# EAGLE design zmFPGA (EAGLE 8.6.3)
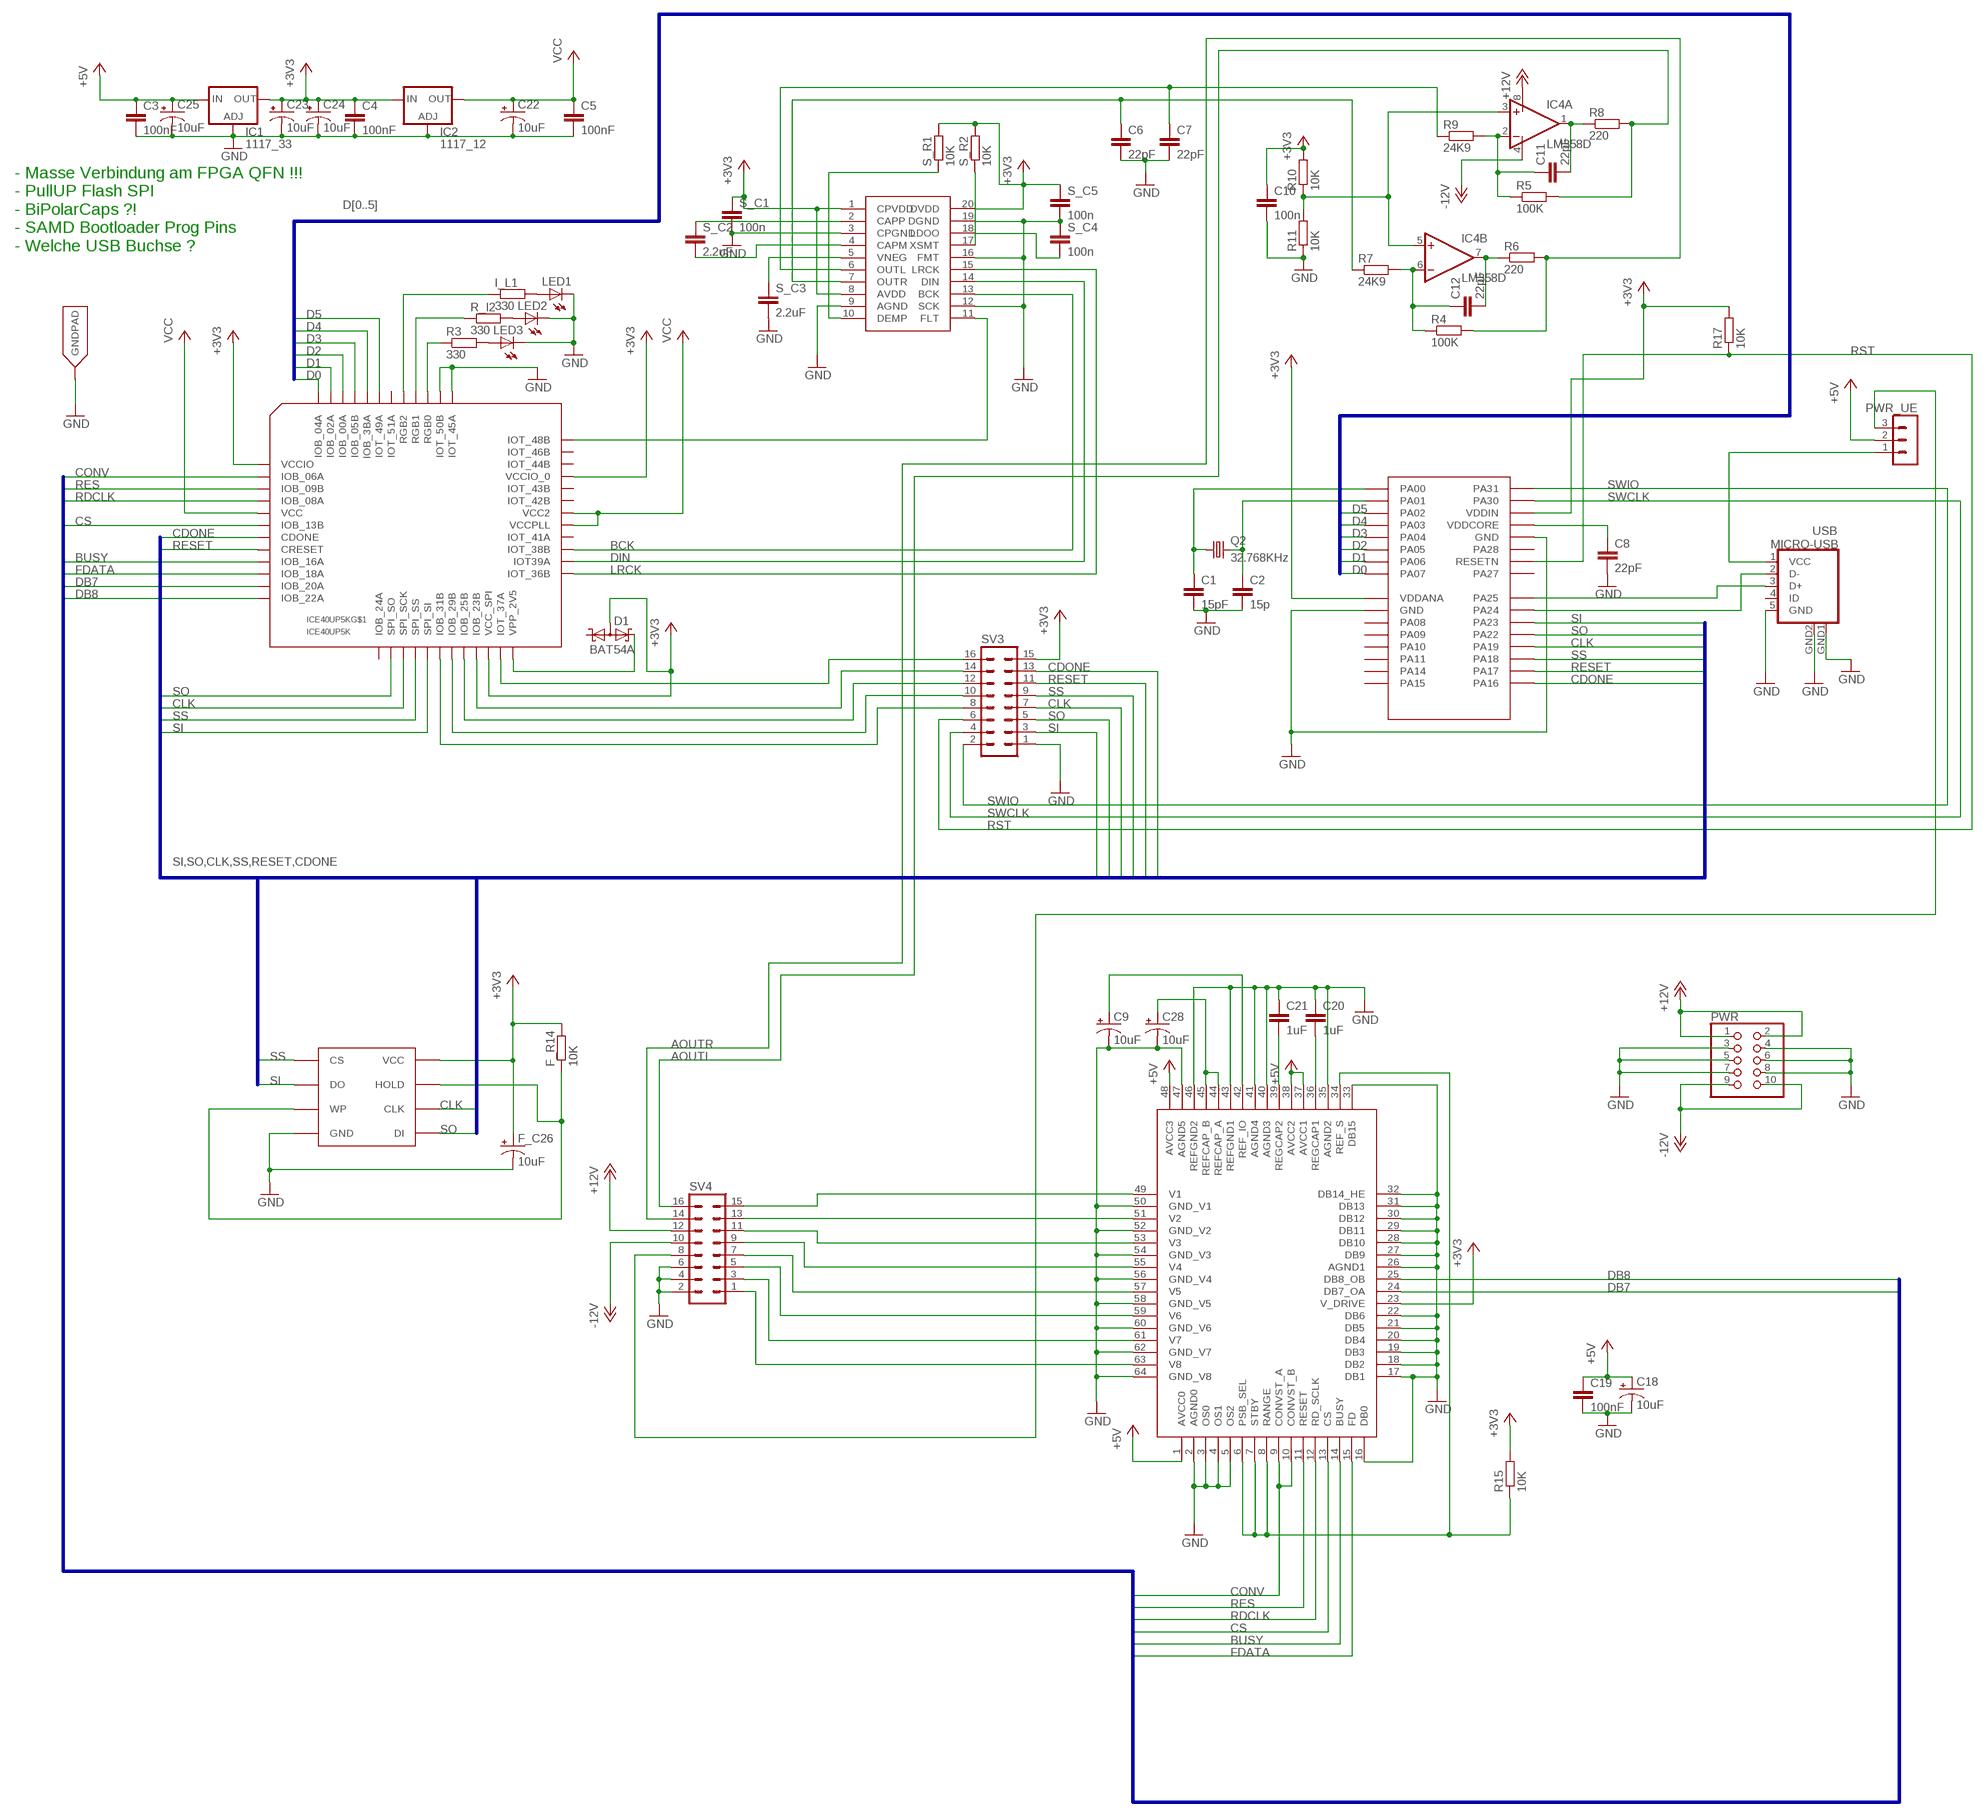
[diagram p0: schematic, sheet 1]

## Parts
AD7606  AD7606  [LQFP64]
C1  15pF  C-EUC0805  [C0805]
C2  15p  C-EUC0805  [C0805]
C3  100nF  C-EUC0805  [C0805]
C4  100nF  C-EUC0805  [C0805]
C5  100nF  C-EUC0805  [C0805]
C6  22pF  C-EUC0805  [C0805]
C7  22pF  C-EUC0805  [C0805]
C8  22pF  C-EUC0805  [C0805]
C9  10uF  10UF-POLAR-EIA3216-16V-10%(TANT)  [EIA3216]
C10  100n  C-EUC0805  [C0805]
C11  22pF  C-EUC0805  [C0805]
C12  22pF  C-EUC0805  [C0805]
C18  10uF  10UF-POLAR-EIA3216-16V-10%(TANT)  [EIA3216]
C19  100nF  C-EUC0805  [C0805]
C20  1uF  C-EUC0805  [C0805]
C21  1uF  C-EUC0805  [C0805]
C22  10uF  10UF-POLAR-EIA3216-16V-10%(TANT)  [EIA3216]
C23  10uF  10UF-POLAR-EIA3216-16V-10%(TANT)  [EIA3216]
C24  10uF  10UF-POLAR-EIA3216-16V-10%(TANT)  [EIA3216]
C25  10uF  10UF-POLAR-EIA3216-16V-10%(TANT)  [EIA3216]
C28  10uF  10UF-POLAR-EIA3216-16V-10%(TANT)  [EIA3216]
D1  BAT54A  [SOT23]
F_C26  10uF  10UF-POLAR-EIA3216-16V-10%(TANT)  [EIA3216]
F_R14  10K  R-EU_R0805  [R0805]
I_L1  330  R-EU_R0805  [R0805]
IC1  1117_33  LD117AS33TR  [SOT223]
IC2  1117_12  LD117AS12TR  [SOT223]
IC4  LM358D  [SO08]
ICE40UP5K  ICE40UP5K  ICE40UP5K_QFN48  [QFN48]
LED1  LEDSMT1206  [1206]
LED2  LEDSMT1206  [1206]
LED3  LEDSMT1206  [1206]
PCM5102  PCM5102  [TSSOP20]
PWR  PINHD-2X5  [2X05]
PWR_UE  MA03-1  [MA03-1]
Q2  32.768KHz  CRYSTALMM39SL  [MM39SL]
R3  330  R-EU_R0805  [R0805]
R4  100K  R-EU_R0805  [R0805]
R5  100K  R-EU_R0805  [R0805]
R6  220  R-EU_R0805  [R0805]
R7  24K9  R-EU_R0805  [R0805]
R8  220  R-EU_R0805  [R0805]
R9  24K9  R-EU_R0805  [R0805]
R10  10K  R-EU_R0805  [R0805]
R11  10K  R-EU_R0805  [R0805]
R15  10K  R-EU_R0805  [R0805]
R17  10K  R-EU_R1206  [R1206]
R_I2  330  R-EU_R0805  [R0805]
S_C1  100n  C-EUC0805  [C0805]
S_C2  2.2uF  C-EUC0805  [C0805]
S_C3  2.2uF  C-EUC0805  [C0805]
S_C4  100n  C-EUC0805  [C0805]
S_C5  100n  C-EUC0805  [C0805]
S_R1  10K  R-EU_R0805  [R0805]
S_R2  10K  R-EU_R0805  [R0805]
SV3  MA08-2  [MA08-2]
SV4  MA08-2  [MA08-2]
U$1  W25Q32  [SOP-8]
U$2  SAMD21_TQFP32  [32-TQFP]
USB  MICRO-USB  [MICRO-USB]

## Nets
5VEXT: PWR_UE.3 SV4.8
+3V3 [VCC]: AD7606.23(V_DRIVE) C4.1 C10.1 C23.+ C24.+ D1.3(AA) F_C26.+ F_R14.2 IC1.4(OUT) IC2.3(IN) ICE40UP5K.1(VCCIO) ICE40UP5K.22(VCC_SPI) ICE40UP5K.33(VCCIO_0) PCM5102.1(CPVDD) PCM5102.8(AVDD) PCM5102.20(DVDD) R10.2 R15.2 R17.2 S_C1.1 S_C5.1 S_R1.2 S_R2.2 SV3.15 U$1.8(VCC) U$2.9(VDDANA) U$2.30(VDDIN)
+5V: AD7606.1(AVCC0) AD7606.37(AVCC1) AD7606.38(AVCC2) AD7606.48(AVCC3) C3.1 C18.+ C19.1 C25.+ IC1.3(IN) PWR_UE.2
+12V: IC4.8(P:V+) PWR.1 PWR.2 SV4.12
-12V: IC4.4(P:V-) PWR.9 PWR.10 SV4.10
AOUTL: R5.2 R8.2 SV4.16
AOUTR: R4.2 R6.2 SV4.14
B23: ICE40UP5K.21(IOB_23B) SV3.14
B25: ICE40UP5K.20(IOB_25B) SV3.12
B29: ICE40UP5K.19(IOB_29B) SV3.10
B31: ICE40UP5K.18(IOB_31B) SV3.8
BCK: ICE40UP5K.27(IOT_38B) PCM5102.13(BCK)
BUSY: AD7606.14(BUSY) ICE40UP5K.9(IOB_16A)
CAPM: PCM5102.4(CAPM) S_C2.2
CAPP: PCM5102.2(CAPP) S_C2.1
CDONE: ICE40UP5K.7(CDONE) SV3.13 U$2.17(PA16)
CLK: ICE40UP5K.15(SPI_SCK) SV3.7 U$1.6(CLK) U$2.20(PA19)
CONV: AD7606.9(CONVST_A) AD7606.10(CONVST_B) ICE40UP5K.2(IOB_06A)
CS: AD7606.13(CS) ICE40UP5K.6(IOB_13B)
D0: ICE40UP5K.48(IOB_04A) U$2.8(PA07)
D1: ICE40UP5K.47(IOB_02A) U$2.7(PA06)
D2: ICE40UP5K.46(IOB_00A) U$2.6(PA05)
D3: ICE40UP5K.45(IOB_05B) U$2.5(PA04)
D4: ICE40UP5K.44(IOB_3BA) U$2.4(PA03)
D5: ICE40UP5K.43(IOT_49A) U$2.3(PA02)
D+: U$2.24(PA25) USB.3(D+)
D-: U$2.23(PA24) USB.2(D-)
DB7: AD7606.24(DB7_OA) ICE40UP5K.11(IOB_20A)
DB8: AD7606.25(DB8_OB) ICE40UP5K.12(IOB_22A)
DIN: ICE40UP5K.26(IOT39A) PCM5102.14(DIN)
FDATA: AD7606.15(FD) ICE40UP5K.10(IOB_18A)
FLASH_H: F_R14.1 U$1.3(WP) U$1.7(HOLD)
FLT: ICE40UP5K.36(IOT_48B) PCM5102.11(FLT)
GND [GND]: AD7606.2(AGND0) AD7606.3(OS0) AD7606.4(OS1) AD7606.5(OS2) AD7606.16(DB0) AD7606.17(DB1) AD7606.18(DB2) AD7606.19(DB3) AD7606.20(DB4) AD7606.21(DB5) AD7606.22(DB6) AD7606.26(AGND1) AD7606.27(DB9) AD7606.28(DB10) AD7606.29(DB11) AD7606.30(DB12) AD7606.31(DB13) AD7606.32(DB14_HE) AD7606.33(DB15) AD7606.35(AGND2) AD7606.40(AGND3) AD7606.41(AGND4) AD7606.43(REFGND1) AD7606.46(REFGND2) AD7606.47(AGND5) AD7606.50(GND_V1) AD7606.52(GND_V2) AD7606.54(GND_V3) AD7606.56(GND_V4) AD7606.58(GND_V5) AD7606.60(GND_V6) AD7606.62(GND_V7) AD7606.64(GND_V8) C1.2 C2.2 C3.2 C4.2 C5.2 C6.2 C7.2 C8.2 C9.- C10.2 C18.- C19.2 C20.1 C21.1 C22.- C23.- C24.- C25.- C28.- F_C26.- IC1.1(ADJ) IC2.1(ADJ) ICE40UP5K.37(IOT_45A) ICE40UP5K.38(IOT_50B) ICE40UP5K.EXP(GNDPAD) LED1.C LED2.C LED3.C PCM5102.3(CPGND) PCM5102.9(AGND) PCM5102.12(SCK) PCM5102.16(FMT) PCM5102.19(DGND) PWR.3 PWR.4 PWR.5 PWR.6 PWR.7 PWR.8 R11.1 S_C1.2 S_C3.2 S_C4.1 S_C5.2 SV3.1 SV4.2 SV4.4 SV4.6 U$1.4(GND) U$2.10(GND) U$2.28(GND) USB.5(GND) USB.GND1(GND) USB.GND2(GND)
LRCK: ICE40UP5K.25(IOT_36B) PCM5102.15(LRCK)
N$1: C8.1 U$2.29(VDDCORE)
N$6: AD7606.63(V8) SV4.1
N$7: AD7606.61(V7) SV4.3
N$8: AD7606.59(V6) SV4.5
N$12: D1.2(K2) ICE40UP5K.24(VPP_2V5)
N$13: AD7606.57(V5) SV4.7
N$14: AD7606.55(V4) SV4.9
N$16: AD7606.53(V3) SV4.11
N$17: AD7606.51(V2) SV4.13
N$19: LED3.A R3.2
N$20: LED2.A R_I2.2
N$21: I_L1.2 LED1.A
N$22: ICE40UP5K.39(RGB0) R3.1
N$23: ICE40UP5K.40(RGB1) R_I2.1
N$24: I_L1.1 ICE40UP5K.41(RGB2)
N$25: C12.2 IC4.7(B:OUT) R6.1
N$26: C11.2 IC4.1(A:OUT) R8.1
N$27: C11.1 IC4.2(A:-IN) R5.1 R9.2
N$29: C12.1 IC4.6(B:-IN) R4.1 R7.2
N$37: PCM5102.17(XSMT) S_R2.1
N$38: PCM5102.10(DEMP) S_R1.1
N$39: PCM5102.18(LDOO) S_C4.2
N$40: AD7606.49(V1) SV4.15
OUTL: C7.1 PCM5102.6(OUTL) R9.1
OUTR: C6.1 PCM5102.7(OUTR) R7.1
PULLUP: AD7606.6(PSB_SEL) AD7606.7(STBY) AD7606.8(RANGE) AD7606.34(REF_S) R15.1
Q1: C1.1 Q2.1 U$2.1(PA00)
Q2: C2.1 Q2.4 U$2.2(PA01)
RDCLK: AD7606.12(RD_SCLK) ICE40UP5K.4(IOB_08A)
REF_INOUT: AD7606.42(REF_IO) C9.+
REFCAP: AD7606.44(REFCAP_A) AD7606.45(REFCAP_B) C28.+
REGCAP1: AD7606.36(REGCAP1) C20.2
REGCAP2: AD7606.39(REGCAP2) C21.2
RES: AD7606.11(RESET) ICE40UP5K.3(IOB_09B)
RESET: ICE40UP5K.8(CRESET) SV3.11 U$2.18(PA17)
RST: R17.1 SV3.6 U$2.26(RESETN)
SI: ICE40UP5K.17(SPI_SI) SV3.3 U$1.2(DO) U$2.22(PA23)
SO: ICE40UP5K.14(SPI_SO) SV3.5 U$1.5(DI) U$2.21(PA22)
SS: ICE40UP5K.16(SPI_SS) SV3.9 U$1.1(CS) U$2.19(PA18)
SWCLK: SV3.4 U$2.31(PA30)
SWIO: SV3.2 U$2.32(PA31)
T37: ICE40UP5K.23(IOT_37A) SV3.16
USB_5V: PWR_UE.1 USB.1(VCC)
V165: IC4.3(A:+IN) IC4.5(B:+IN) R10.1 R11.2
VCC: C5.1 C22.+ IC2.4(OUT) ICE40UP5K.5(VCC) ICE40UP5K.29(VCCPLL) ICE40UP5K.30(VCC2)
VNEG: PCM5102.5(VNEG) S_C3.1
Unconnected: D1.1(K1) ICE40UP5K.13(IOB_24A) ICE40UP5K.28(IOT_41A) ICE40UP5K.31(IOT_42B) ICE40UP5K.32(IOT_43B) ICE40UP5K.34(IOT_44B) ICE40UP5K.35(IOT_46B) ICE40UP5K.42(IOT_51A) U$2.11(PA08) U$2.12(PA09) U$2.13(PA10) U$2.14(PA11) U$2.15(PA14) U$2.16(PA15) U$2.25(PA27) U$2.27(PA28) USB.4(ID)

## Buses
D[0..5]
SI,SO,CLK,SS,RESET,CDONE
CONV,RES,RDCLK,CS,BUSY,FDATA,DB7,DB8

## Notes on the sheet
- - Masse Verbindung am FPGA QFN !!!
  - PullUP Flash SPI
  - BiPolarCaps ?!
  - SAMD Bootloader Prog Pins
  - Welche USB Buchse ?

## Library data of the parts
AD7606 = nxp_packages:AD7606
C1-C8 C10-C12 C19-C21 S_C1-S_C5 = rcl:C-EU: CAPACITOR, European symbol; SPICEPREFIX: C
C9 C18 C22-C25 C28 F_C26 = SparkFun-Capacitors:10UF-POLAR: 10.0µF polarized capacitors A capacitor is a passive two-terminal electrical component used to store electrical energy temporarily in an electric field.; PROD_ID: CAP-00811
D1 = diode:BAT54A: Schottky Diodes Source: Fairchild .. BAT54.pdf
F_R14 I_L1 R3-R11 R15 R17 R_I2 S_R1 S_R2 = rcl:R-EU_: RESISTOR, European symbol; SPICEPREFIX: R
IC1 IC2 = v-reg:LD117A?*: Low drop fixed and adjustable positive voltage regulators 1 A Source: http://www.st.com/stonline/products/literature/ds/7194/ld1117axx.pdf
IC4 = linear:LM358: OP AMP also LM158; LM258; LM2904 Source: http://cache.national.com/ds/LM/LM158.pdf
ICE40UP5K = ice40up5_qfn48:ICE40UP5K_QFN48
LED1-LED3 = led:LED: LED OSRAM: - CHIPLED LG R971, LG N971, LY N971, LG Q971, LY Q971, LO R971, LY R971 LH N974, LH R974 LS Q976, LO Q976, LY Q976 LO Q996 - Hyper CHIPLED LW Q18S LB Q993, LB Q99A, LB R99A - SideLED LS A670, LO A670, LY A670, LG A670, LP A670 LB A673, LV A673, LT A673, LW A673 LH A674 LY A675 LS A676, LA A676, LO A676, LY A676, LW A676 LS A679, LY A679, LG A679 - Hyper Micro SIDELED® LS Y876, LA Y876, LO Y876, LY Y876 LT Y87S - SmartLED LW L88C, LW L88S LB L89C, LB L89S, LG L890 LS L89K, LO L89K, LY L89K LS L896, LA L896, LO L896, LY L896 - TOPLED LS T670, LO T670, LY T670, LG T670, LP T670 LSG T670, LSP T670, LSY T670, LOP T670, LYG T670 LG T671, LOG T671, LSG T671 LB T673, LV T673, LT T673, LW T673 LH T674 LS T676, LA T676, LO T676, LY T676, LB T676, LH T676, LSB T676, LW T676 LB T67C, LV T67C, LT T67C, LS T67K, LO T67K, LY T67K, LW E67C LS E67B, LA E67B, LO E67B, LY E67B, LB E67C, LV E67C, LT E67C LW T67C LS T679, LY T679, LG T679 LS T770, LO T770, LY T770, LG T770, LP T770 LB T773, LV T773, LT T773, LW T773 LH T774 LS E675, LA E675, LY E675, LS T675 LS T776, LA T776, LO T776, LY T776, LB T776 LHGB T686 LT T68C, LB T68C - Hyper Mini TOPLED® LB M676 - Mini TOPLED Santana® LG M470 LS M47K, LO M47K, LY M47K Source: http://www.osram.convergy.de LUXEON: - LUMILED® LXK2-PW12-R00, LXK2-PW12-S00, LXK2-PW14-U00, LXK2-PW14-V00 LXK2-PM12-R00, LXK2-PM12-S00, LXK2-PM14-U00 LXK2-PE12-Q00, LXK2-PE12-R00, LXK2-PE12-S00, LXK2-PE14-T00, LXK2-PE14-U00 LXK2-PB12-K00, LXK2-PB12-L00, LXK2-PB12-M00, LXK2-PB14-N00, LXK2-PB14-P00, LXK2-PB14-Q00 LXK2-PR12-L00, LXK2-PR12-M00, LXK2-PR14-Q00, LXK2-PR14-R00 LXK2-PD12-Q00, LXK2-PD12-R00, LXK2-PD12-S00 LXK2-PH12-R00, LXK2-PH12-S00 LXK2-PL12-P00, LXK2-PL12-Q00, LXK2-PL12-R00 Source: www.luxeon.com KINGBRIGHT: KA-3528ASYC Source: www.kingbright.com
PCM5102 = PCM5102:PCM5102
PWR = pinhead:PINHD-2X5: PIN HEADER
PWR_UE = con-lstb:MA03-1: PIN HEADER; OC_FARNELL: unknown; OC_NEWARK: unknown
Q2 = adafruit:CRYSTAL: CRYSTAL; OC_FARNELL: unknown; OC_NEWARK: unknown
SV3 SV4 = con-lstb:MA08-2: PIN HEADER; OC_FARNELL: unknown; OC_NEWARK: unknown
U$1 = W25Q32_FLASH:W25Q32
U$2 = atmel-samd21:SAMD21_TQFP32
USB = microusb:MICRO-USB: Micro USB B connector

## Net classes
0 default: width 0.152 mm
1 GND: width 0.305 mm
2 VCC: width 0.203 mm

## Board
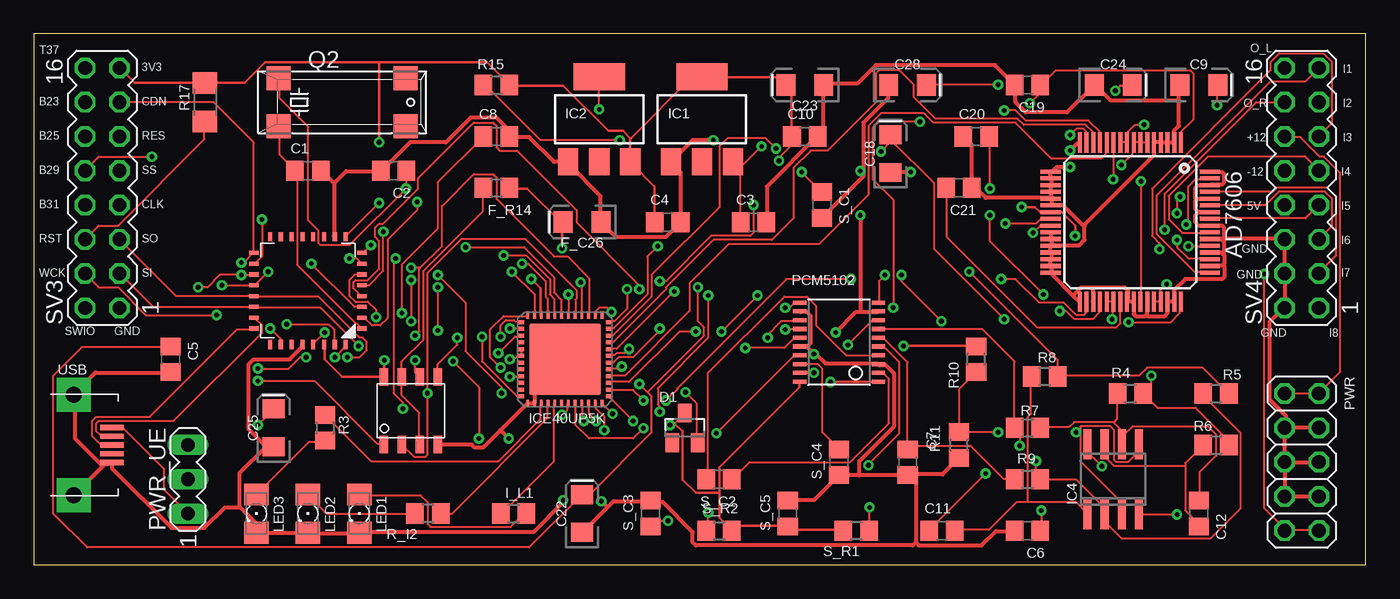
[diagram p1: board, top side]
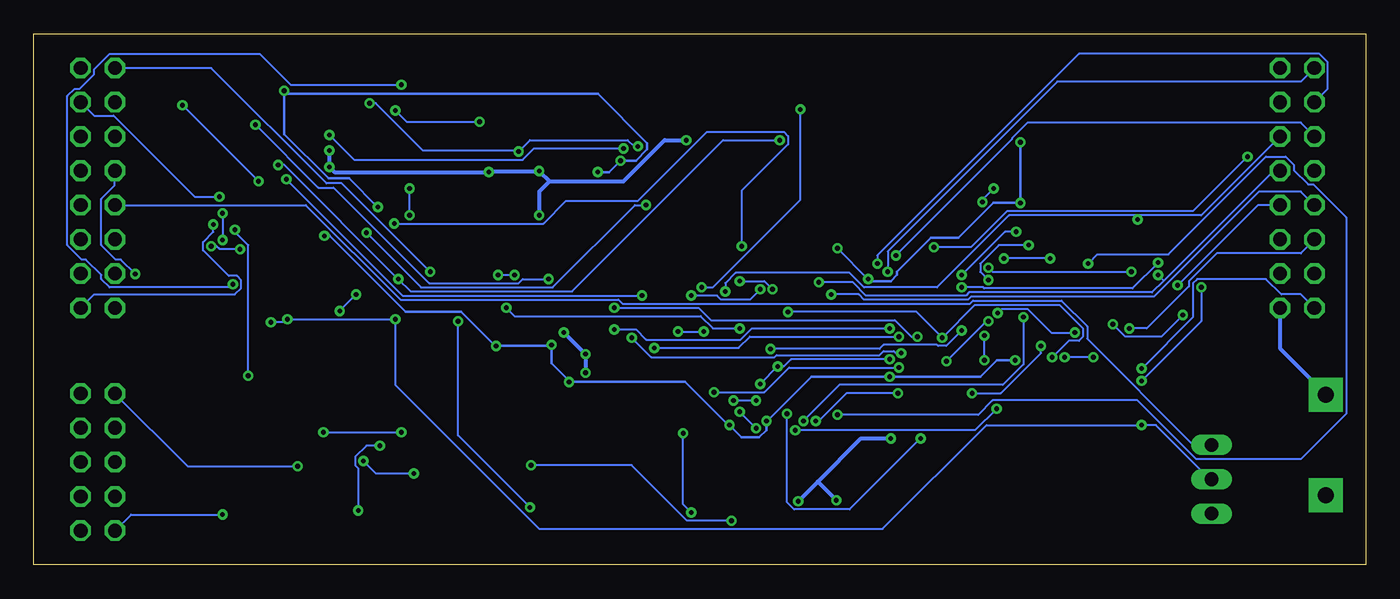
[diagram p2: board, bottom side, seen from below]

Size 98.73 x 39.36 mm. Coordinates in mm from the lower left corner, seen from the top.
Outline: 0,0 98.73,0 98.73,39.36 0,39.36 0,0
Copper layers (1*16): Top 0.035mm / dielectric 1.5mm / Bottom 0.035mm
Design rules "default *": minimum track width 6mil, minimum drill 0.35mm, track to track 6mil, track to pad 6mil, pad to pad 6mil, via to via 6mil, smd to smd 6mil, copper to edge 40mil, drill to drill 6mil, minimum pad ring 10mil, minimum via ring 8mil, stop-mask expansion 4mil, vias tented up to drill 21mil, thermal gap 10mil

### Footprints (pad centres in the part's own frame; a part is rotated, then mirrored left to right if it is on the bottom)
LQFP64 = smd 1.5 x 0.3: 1 -5.9,3.75; 2 -5.9,3.25; 3 -5.9,2.75; 4 -5.9,2.25; 5 -5.9,1.75; 6 -5.9,1.25; 7 -5.9,0.75; 8 -5.9,0.25; 9 -5.9,-0.25; 10 -5.9,-0.75; 11 -5.9,-1.25; 12 -5.9,-1.75; 13 -5.9,-2.25; 14 -5.9,-2.75; 15 -5.9,-3.25; 16 -5.9,-3.75; 33 5.9,-3.75; 34 5.9,-3.25; 35 5.9,-2.75; 36 5.9,-2.25; 37 5.9,-1.75; 38 5.9,-1.25; 39 5.9,-0.75; 40 5.9,-0.25; 41 5.9,0.25; 42 5.9,0.75; 43 5.9,1.25; 44 5.9,1.75; 45 5.9,2.25; 46 5.9,2.75; 47 5.9,3.25; 48 5.9,3.75 | smd 0.3 x 1.5: 17 -3.75,-5.9; 18 -3.25,-5.9; 19 -2.75,-5.9; 20 -2.25,-5.9; 21 -1.75,-5.9; 22 -1.25,-5.9; 23 -0.75,-5.9; 24 -0.25,-5.9; 25 0.25,-5.9; 26 0.75,-5.9; 27 1.25,-5.9; 28 1.75,-5.9; 29 2.25,-5.9; 30 2.75,-5.9; 31 3.25,-5.9; 32 3.75,-5.9; 49 3.75,5.9; 50 3.25,5.9; 51 2.75,5.9; 52 2.25,5.9; 53 1.75,5.9; 54 1.25,5.9; 55 0.75,5.9; 56 0.25,5.9; 57 -0.25,5.9; 58 -0.75,5.9; 59 -1.25,5.9; 60 -1.75,5.9; 61 -2.25,5.9; 62 -2.75,5.9; 63 -3.25,5.9; 64 -3.75,5.9
C0805 = smd 1.3 x 1.5: 1 -0.95,0; 2 0.95,0
EIA3216 = smd 1.4 x 1.6: + 1.4,0; - -1.4,0
SOT23 = smd 1 x 1.4: 1 -0.95,-1.1; 2 0.95,-1.1; 3 0,1.1
R0805 = smd 1.3 x 1.5: 1 -0.95,0; 2 0.95,0
SOT223 = smd 1.5 x 2: 1 -2.3,-3.15; 2 0,-3.15; 3 2.3,-3.15 | smd 3.8 x 2: 4 0,3.15
SO08 = smd 0.6 x 2.2: 1 -1.905,-2.6; 2 -0.635,-2.6; 3 0.635,-2.6; 4 1.905,-2.6; 5 1.905,2.6; 6 0.635,2.6; 7 -0.635,2.6; 8 -1.905,2.6
QFN48 = smd 0.55 x 0.3: 1 -3.275,2.75; 2 -3.275,2.25; 3 -3.275,1.75; 4 -3.275,1.25; 5 -3.275,0.75; 6 -3.275,0.25; 7 -3.275,-0.25; 8 -3.275,-0.75; 9 -3.275,-1.25; 10 -3.275,-1.75; 11 -3.275,-2.25; 12 -3.275,-2.75; 25 3.275,-2.75; 26 3.275,-2.25; 27 3.275,-1.75; 28 3.275,-1.25; 29 3.275,-0.75; 30 3.275,-0.25; 31 3.275,0.25; 32 3.275,0.75; 33 3.275,1.25; 34 3.275,1.75; 35 3.275,2.25; 36 3.275,2.75 | smd 0.3 x 0.55: 13 -2.75,-3.275; 14 -2.25,-3.275; 15 -1.75,-3.275; 16 -1.25,-3.275; 17 -0.75,-3.275; 18 -0.25,-3.275; 19 0.25,-3.275; 20 0.75,-3.275; 21 1.25,-3.275; 22 1.75,-3.275; 23 2.25,-3.275; 24 2.75,-3.275; 37 2.75,3.275; 38 2.25,3.275; 39 1.75,3.275; 40 1.25,3.275; 41 0.75,3.275; 42 0.25,3.275; 43 -0.25,3.275; 44 -0.75,3.275; 45 -1.25,3.275; 46 -1.75,3.275; 47 -2.25,3.275; 48 -2.75,3.275 | smd 5.309 x 5.309: EXP 0,0
1206 = smd 1.6 x 1.803: A -1.422,0; C 1.422,0
TSSOP20 = smd 0.305 x 0.991: 1 -2.925,-2.918; 2 -2.275,-2.918; 3 -1.625,-2.918; 4 -0.975,-2.918; 5 -0.325,-2.918; 6 0.325,-2.918; 7 0.975,-2.918; 8 1.625,-2.918; 9 2.275,-2.918; 10 2.925,-2.918; 11 2.925,2.918; 12 2.275,2.918; 13 1.625,2.918; 14 0.975,2.918; 15 0.325,2.918; 16 -0.325,2.918; 17 -0.975,2.918; 18 -1.625,2.918; 19 -2.275,2.918; 20 -2.925,2.918
2X05 = drill 1.016 octagon: 1 -5.08,-1.27; 2 -5.08,1.27; 3 -2.54,-1.27; 4 -2.54,1.27; 5 0,-1.27; 6 0,1.27; 7 2.54,-1.27; 8 2.54,1.27; 9 5.08,-1.27; 10 5.08,1.27
MA03-1 = drill 1.016 long: 1 -2.54,0; 2 0,0; 3 2.54,0
MM39SL = smd 1.778 x 1.778: 1 -4.699,-1.778; 2 4.699,-1.778; 3 4.699,1.778; 4 -4.699,1.778
R1206 = smd 1.6 x 1.803: 1 -1.422,0; 2 1.422,0
MA08-2 = drill 1.016 octagon: 1 -8.89,-1.27; 2 -8.89,1.27; 3 -6.35,-1.27; 4 -6.35,1.27; 5 -3.81,-1.27; 6 -3.81,1.27; 7 -1.27,-1.27; 8 -1.27,1.27; 9 1.27,-1.27; 10 1.27,1.27; 11 3.81,-1.27; 12 3.81,1.27; 13 6.35,-1.27; 14 6.35,1.27; 15 8.89,-1.27; 16 8.89,1.27
SOP-8 = smd 1.27 x 0.635: 1 -2.5,2; 2 -2.5,0.67; 3 -2.5,-0.67; 4 -2.5,-2; 5 2.5,-2; 6 2.5,-0.67; 7 2.5,0.67; 8 2.5,2
32-TQFP = smd 0.7 x 0.3: 1 -4,2.8; 2 -4,2; 3 -4,1.2; 4 -4,0.4; 5 -4,-0.4; 6 -4,-1.2; 7 -4,-2; 8 -4,-2.8; 17 4,-2.8; 18 4,-2; 19 4,-1.2; 20 4,-0.4; 21 4,0.4; 22 4,1.2; 23 4,2; 24 4,2.8 | smd 0.3 x 0.7: 9 -2.8,-4; 10 -2,-4; 11 -1.2,-4; 12 -0.4,-4; 13 0.4,-4; 14 1.2,-4; 15 2,-4; 16 2.8,-4; 25 2.8,4; 26 2,4; 27 1.2,4; 28 0.4,4; 29 -0.4,4; 30 -1.2,4; 31 -2,4; 32 -2.8,4
MICRO-USB = smd 0.4 x 1.75: 1 -1.3,4.525; 2 -0.65,4.525; 3 0,4.525; 4 0.65,4.525; 5 1.3,4.525 | drill 1.2 pad 2.54 square: GND1 -3.725,1.7; GND2 3.725,1.7

### Placement (x,y rotation side)
AD7606  81.28,25.4 270 top
C1  20.32,29.21 0 top
C2  26.67,29.21 180 top
C3  53.34,25.4 0 top
C4  46.99,25.4 0 top
C5  10.16,15.24 270 top
C6  73.66,2.54 180 top
C7  64.77,7.62 270 top
C8  34.29,31.75 0 top
C9  86.36,35.56 0 top
C10  57.15,31.75 0 top
C11  67.31,2.54 0 top
C12  86.36,3.81 270 top
C18  63.5,30.48 90 top
C19  73.66,35.56 180 top
C20  69.85,31.75 0 top
C21  68.58,27.94 180 top
C22  40.64,3.81 90 top
C23  57.15,35.56 180 top
C24  80.01,35.56 0 top
C25  17.78,10.16 90 top
C28  64.77,35.56 0 top
D1  48.26,10.16 0 top
F_C26  40.64,25.4 180 top
F_R14  34.29,27.94 0 top
I_L1  35.56,3.81 0 top
IC1  49.53,33.02 0 top
IC2  41.91,33.02 0 top
IC4  80.01,6.35 0 top
ICE40UP5K  39.37,15.24 180 top
LED1  24.13,3.81 270 top
LED2  20.32,3.81 270 top
LED3  16.51,3.81 270 top
PCM5102  59.69,16.51 90 top
PWR  93.98,7.62 270 top
PWR_UE  11.43,6.35 90 top
Q2  22.86,34.29 0 top
R3  21.59,10.16 270 top
R4  81.28,12.7 0 top
R5  87.63,12.7 0 top
R6  87.63,8.89 0 top
R7  73.66,10.16 0 top
R8  74.93,13.97 0 top
R9  73.66,6.35 0 top
R10  69.85,15.24 90 top
R11  68.58,8.89 90 top
R15  34.29,35.56 0 top
R17  12.7,34.29 90 top
R_I2  29.21,3.81 180 top
S_C1  58.42,26.67 270 top
S_C2  50.8,6.35 180 top
S_C3  45.72,3.81 90 top
S_C4  59.69,7.62 90 top
S_C5  55.88,3.81 90 top
S_R1  60.96,2.54 180 top
S_R2  50.8,2.54 0 top
SV3  5.08,27.94 90 top
SV4  93.98,27.94 90 top
U$1  27.94,11.43 90 top
U$2  20.32,20.32 180 top
USB  1.27,8.89 270 top

### Tracks (layer width: path | path; a pad name or v marks a point on that pad's centre or on a via)
5VEXT
  Bottom 0.152: SV4.8 78.56,26.67 71.55,19.66 55.4,19.66 55.09,19.36 29.34,19.36 29.11,19.58 22.55,19.58 20.65,17.68 20.65,16.76 12.8,8.91 11.43,8.91 PWR_UE.3
+3V3  (via drill 0.35)
  Top 0.203: v36.88,21.18 37.57,20.5 37.57,18.52 ICE40UP5K.22 | v39.17,23.47 39.17,25.38 F_C26.+ 39.09,25.38 36.58,27.89 35.28,27.89 F_R14.2 | v25.6,26.82 23.16,24.38 U$2.9 | v56.92,29.11 58.37,27.66 S_C1.1 | v55.24,29.95 55.24,30.18 56.16,31.09 56.16,31.7 C10.1 56.16,31.77 56.16,35.13 55.78,35.51 C23.+ 55.7,35.59 55.17,36.12 49.53,36.12 IC1.4 49.45,36.12 48.77,36.12 44.27,31.62 44.2,31.62 | SV3.15 6.4,36.8 7.47,35.74 12.65,35.74 R17.2 12.72,35.74 15.62,35.74 17.14,37.26 25.6,37.26 | C4.1 46.02,25.45 46.02,28.04 44.27,29.79 IC2.3 44.2,29.95 44.2,31.62 | 44.2,31.62 43.66,32.16 42.6,32.16 39.24,35.51 35.28,35.51 R15.2 35.2,35.66 33.6,37.26 25.6,37.26 | 25.6,37.26 v25.6,31.32 | S_R1.2 59.97,2.59 56.16,2.59 55.93,2.82 S_C5.1 55.78,2.9 52.12,2.9 51.82,2.59 S_R2.2 51.74,2.59 50.83,3.5 50.83,5.33 | 50.83,5.33 50.83,7.24 56.77,13.18 56.77,13.56 PCM5102.20 | U$2.30 21.57,16.31 21.57,15.24 22.86,13.95 25.91,13.95 U$1.8 25.98,14.02 v25.98,15.16 | v44.42,10.67 42.67,12.42 ICE40UP5K.1 | v47.17,10.36 47.4,10.36 47.51,10.48 | 47.51,10.48 48.23,11.2 D1.3 | v35.28,13.95 36.04,13.95 ICE40UP5K.33 | v59.05,13.56 62.56,13.56 PCM5102.1 | v60.35,16.31 62.1,18.06 62.56,18.06 PCM5102.8 | v64.47,16.23 69.8,16.23 R10.2 | v77.19,24.38 77.19,25.15 76.2,26.14 75.44,26.14 AD7606.23 75.29,26.14 74.6,26.14 74.22,26.52 v73.23,26.52 | v80.16,35.13 80.54,35.51 81.38,35.51 C24.+ | 50.83,5.33 49.07,5.33 48.08,6.33 48.08,9.91 47.51,10.48
  Bottom 0.203: v39.17,23.47 v36.88,21.18 36.8,21.18 36.65,21.03 35.2,21.03 34.75,21.49 34.75,21.72 32.23,24.23 30.18,24.23 27.58,26.82 v25.6,26.82 v25.6,31.32 | v56.92,29.11 56.08,29.11 v55.24,29.95 54.1,29.95 53.26,30.79 53.26,31.24 56.92,34.9 80.09,34.9 v80.16,35.13 80.16,31.93 76.89,28.65 75.36,28.65 v73.23,26.52 | v77.19,24.38 76.81,24.38 71.17,18.75 67.06,18.75 64.54,16.23 v64.47,16.23 60.43,16.23 v60.35,16.31 60.35,14.94 59.05,13.64 v59.05,13.56 50.44,13.56 47.24,10.36 v47.17,10.36 46.25,9.45 44.96,9.45 44.42,9.98 v44.42,10.67 44.35,10.67 41.07,13.95 v35.28,13.95 28.57,13.95 27.36,15.16 v25.98,15.16
+5V  (via drill 0.35)
  Top 0.152: AD7606.1 85.04,31.32 85.04,32.08 85.95,32.99 85.95,36.42 85.72,36.65 75.74,36.65 74.68,35.59 C19.1 74.6,35.51 74.6,34.98 v73.84,34.21 | v16.61,10.36 17.75,11.51 C25.+ | C3.1 52.35,25.45 52.35,29.34 51.89,29.79 IC1.3 52.35,29.41 v53.95,31.01 | 79.93,19.51 80.01,19.51 AD7606.38 79.93,19.51 | 79.93,19.51 79.55,19.51 AD7606.37 | v81.15,17.98 84.28,17.98 84.96,18.67 84.96,19.43 AD7606.48 | 79.93,19.51 v79.93,18.21 | v71.93,18.21 66.75,23.39 66.75,28.27 63.55,31.47 63.55,31.85 C18.+ 63.55,31.39 v62.79,30.63
  Bottom 0.152: PWR_UE.2 11.43,6.4 11.58,6.4 15.54,10.36 v16.61,10.36 28.12,10.36 35.81,2.67 61.27,2.67 71.93,13.34 v71.93,18.21 v79.93,18.21 80.16,17.98 v81.15,17.98 | v53.95,31.01 54.25,31.01 54.71,31.47 61.95,31.47 v62.79,30.63 62.79,30.71 69.88,30.71 73.38,34.21 v73.84,34.21
+12V  (via drill 0.35)
  Top 0.152: IC4.8 78.11,8.38 v79.17,7.32 | 95.25,12.72 92.73,12.72 PWR.1 | 95.25,12.72 96.85,14.33 96.85,29.03 95.63,30.25 95.33,30.25 93.88,31.7 92.73,31.7 SV4.12 | 95.25,12.72 PWR.2
  Bottom 0.152: v79.17,7.32 87.33,7.32 PWR.1
-12V  (via drill 0.35)
  Top 0.152: v84.73,3.73 81.92,3.73 IC4.4 | PWR.10 95.25,2.59 92.73,2.59 PWR.9 92.73,2.67 91.21,4.19 v91.21,21.57
  Bottom 0.152: v84.73,3.73 91.52,3.73 PWR.9 | v91.21,21.57 92.28,22.63 92.66,22.63 93.73,23.7 93.73,27.13 92.73,28.12 92.73,29.18 SV4.10
AOUTL  (via drill 0.35)
  Top 0.152: R5.2 88.54,12.72 86.64,14.63 82.53,14.63 81.92,14.02 75.89,14.02 R8.2 75.89,14.1 75.89,15.16 v69.34,21.72
  Bottom 0.152: v69.34,21.72 75.89,28.27 77.04,28.27 85.57,36.8 92.66,36.8 SV4.16
AOUTR  (via drill 0.35)
  Top 0.152: R6.2 88.54,8.91 88.54,9.22 86.11,11.66 83.29,11.66 82.3,12.65 R4.2 82.3,12.72 82.83,13.26 v82.83,14.02 | SV4.14 90.6,34.29 83.82,27.51 v83.82,24.84
  Bottom 0.152: v83.82,24.84 83.82,24.69 82.83,23.7 v82.83,14.02
B23  (via drill 0.35)
  Top 0.152: v36.2,22.33 36.65,22.33 37.95,21.03 37.95,19.89 38.1,19.74 38.1,18.52 ICE40UP5K.21
  Bottom 0.152: v36.2,22.33 36.2,22.94 21.26,37.87 3.43,37.87 2.82,37.26 2.82,35.28 SV3.14
B25  (via drill 0.35)
  Top 0.152: v34.82,22.94 36.5,22.94 38.25,21.18 38.25,20.04 38.56,19.74 38.56,18.52 ICE40UP5K.20
  Bottom 0.152: v34.82,22.94 26.21,31.55 26.21,31.62 25.07,32.77 4.8,32.77 3.81,31.77 SV3.12
B29  (via drill 0.35)
  Top 0.152: v32,23.55 36.35,23.55 38.56,21.34 38.56,20.19 39.09,19.66 39.09,18.52 ICE40UP5K.19 | v8.76,30.25 4.8,30.25 3.81,29.26 SV3.10
  Bottom 0.152: v32,23.55 29.26,23.55 26.59,26.21 12.8,26.21 v8.76,30.25
B31  (via drill 0.35)
  Top 0.152: v39.62,20.04 ICE40UP5K.18
  Bottom 0.152: v39.62,20.04 37.57,20.04 37.19,19.66 29.49,19.66 29.26,19.89 15.7,19.89 7.92,27.66 4.8,27.66 SV3.8
BCK  (via drill 0.35)
  Top 0.152: v34.44,15.7 35.66,16.92 36.04,16.92 ICE40UP5K.27 | v54.41,16.84 54.41,17.07 55.4,18.06 56.77,18.06 PCM5102.13
  Bottom 0.152: v34.44,15.7 34.82,15.7 34.98,15.85 35.74,15.85 36.04,15.54 43.66,15.54 43.81,15.39 52.96,15.39 v54.41,16.84
BUSY
  Top 0.152: ICE40UP5K.9 42.67,16.54 42.98,16.54 46.86,20.42 46.86,20.57 50.37,24.08 54.71,24.08 56.31,25.68 56.31,29.41 57.61,30.71 58.83,30.71 62.41,34.29 62.41,36.42 62.64,36.65 64.16,36.65 65.23,35.59 65.23,34.67 66.83,33.07 72.92,33.07 73.38,32.61 77.95,32.61 78.49,32.08 78.49,31.32 AD7606.14
CAPM
  Top 0.152: PCM5102.4 62.56,15.54 60.2,15.54 57.99,17.75 57.99,19.2 57.3,19.89 55.63,19.89 49.99,14.25 49.99,6.48 49.91,6.4 S_C2.2
CAPP
  Top 0.152: PCM5102.2 62.64,14.17 63.02,14.17 63.4,13.79 63.4,10.52 60.5,7.62 53.03,7.62 51.82,6.4 S_C2.1
CDONE  (via drill 0.35)
  Top 0.152: v44.12,16 43.81,15.7 43.2,15.7 43.05,15.54 42.67,15.54 ICE40UP5K.7 | v29.95,20.57 v29.95,17.37 | v15.39,22.4 15.54,22.4 16.31,23.16 U$2.17 16.31,23.24 16.31,31.32 13.34,34.29 SV3.13
  Bottom 0.152: v44.12,16 36.04,16 35.74,16.31 31.77,16.31 31.7,16.23 31.09,16.23 v29.95,17.37 | v29.95,20.57 28.35,20.57 28.27,20.5 17.3,20.5 v15.39,22.4
CLK  (via drill 0.35)
  Top 0.152: v13.95,20.73 16.31,20.73 U$2.20 16.38,20.73 v17.37,21.72 | 28.61,21.98 28.57,21.95 28.57,17.3 v28.27,16.99 | 28.61,21.98 30.25,23.62 30.25,26.59 32.61,28.96 34.06,28.96 34.29,28.73 34.29,27.13 38.56,22.86 39.55,22.86 41.15,21.26 41.15,18.52 ICE40UP5K.15 | v28.27,15.16 28.27,14.25 28.57,13.95 U$1.6 | v27.96,22.02 28.57,22.02 28.61,21.98
  Bottom 0.152: v13.95,20.73 8,26.67 SV3.7 | v28.27,15.16 v28.27,16.99 | v17.37,21.72 27.66,21.72 v27.96,22.02
CONV  (via drill 0.35)
  Top 0.152: v45.19,12.19 44.42,12.95 42.67,12.95 ICE40UP5K.2 | v46.86,12.19 47.7,13.03 47.7,13.11 55.78,21.18 v60.58,21.18 | v82.3,32.61 81.61,32.61 81.08,32.08 81.08,31.32 AD7606.9 81,31.32 80.54,31.32 AD7606.10
  Bottom 0.152: v46.86,12.19 v45.19,12.19 | v60.58,21.18 62.48,21.18 62.79,20.88 69.42,20.88 76.5,27.96 77.65,27.96 v82.3,32.61
CS  (via drill 0.35)
  Top 0.152: v46.41,17.53 46.41,17.37 44.42,15.39 43.36,15.39 42.98,15.01 42.67,15.01 ICE40UP5K.6 | v63.7,19.05 63.7,27.05 62.18,28.57 62.18,32.38 62.64,32.84 v65.68,32.84 | v71.93,33.68 72.77,33.68 73.53,32.92 78.18,32.92 79.02,32.08 79.02,31.32 AD7606.13
  Bottom 0.152: v46.41,17.53 48.39,17.53 49.3,18.44 63.09,18.44 v63.7,19.05 | v65.68,32.84 71.09,32.84 v71.93,33.68
D0  (via drill 0.35)
  Top 0.152: v42.9,11.2 42.14,11.96 ICE40UP5K.48 | v32.99,9.37 32.99,13.18 v31.09,15.09 | v27.96,21.11 v27.96,18.06 | v24.99,23.7 24.38,23.09 U$2.8
  Bottom 0.152: v42.9,11.2 42.9,4.65 42.37,4.12 38.25,4.12 v32.99,9.37 | v31.09,15.09 28.12,18.06 v27.96,18.06 | v27.96,21.11 28.57,21.72 28.57,22.33 27.2,23.7 v24.99,23.7
D1  (via drill 0.35)
  Top 0.152: v42.29,9.98 42.29,10.97 41.68,11.58 41.68,11.96 ICE40UP5K.47 | v27.36,11.58 27.36,12.04 26.67,12.72 26.67,22.55 v26.82,22.71 | v23.39,22.71 23.93,22.71 24.31,22.33 U$2.7
  Bottom 0.152: v42.29,9.98 28.96,9.98 v27.36,11.58 | v23.39,22.71 v26.82,22.71
D2  (via drill 0.35)
  Top 0.152: v41.68,10.67 41.15,11.2 41.15,11.96 ICE40UP5K.46 | v25.38,18.36 25.38,18.9 24.77,19.51 23.85,19.51 23.39,19.96 23.39,21.11 23.77,21.49 24.31,21.49 U$2.6
  Bottom 0.152: v41.68,10.67 39.01,13.34 26.9,13.34 25.38,14.86 v25.38,18.36
D3  (via drill 0.35)
  Top 0.152: v40.77,10.67 40.69,10.74 40.69,11.96 ICE40UP5K.45 | v34.67,12.72 34.67,13.18 32,15.85 32,19.43 v29.95,21.49 | v25.91,24.69 25.91,21.79 24.84,20.73 24.38,20.73 U$2.5
  Bottom 0.152: v40.77,10.67 40.54,10.67 38.48,12.72 v34.67,12.72 | v29.95,21.49 26.75,24.69 v25.91,24.69
D4  (via drill 0.35)
  Top 0.152: v45.19,10.13 44.42,9.37 41.15,9.37 40.16,10.36 40.16,11.96 ICE40UP5K.44 | v46.41,11.35 46.41,11.73 46.25,11.89 46.25,13.11 49.99,16.84 v49.99,19.96 | v44.88,20.42 44.88,20.73 40.23,25.38 40.23,26.29 35.81,30.71 34.52,30.71 34.29,30.94 34.29,32.54 34.06,32.77 32.61,32.77 28.5,28.65 28.5,27.89 25.91,25.3 25.6,25.3 25.3,24.99 25.3,24.31 25.6,24 25.6,21.95 24.77,21.11 23.85,21.11 23.7,20.95 23.7,20.5 24.31,19.89 U$2.4
  Bottom 0.152: v46.41,11.35 v45.19,10.13 | v49.99,19.96 48.08,19.96 47.78,19.66 45.64,19.66 v44.88,20.42
D5  (via drill 0.35)
  Top 0.152: v39.17,11.12 39.55,11.51 39.55,11.96 ICE40UP5K.43 | v20.57,22.33 23.77,19.13 24.31,19.13 U$2.3
  Bottom 0.152: v39.17,11.12 28.73,11.12 27.66,12.19 16.92,12.19 12.57,7.85 4.8,7.85 1.45,11.2 1.45,25.76 3.89,28.19 4.27,28.19 5.33,29.26 5.33,29.64 5.94,30.25 7.39,30.25 14.63,23.01 19.89,23.01 v20.57,22.33
D+
  Top 0.152: U$2.24 16.31,17.45 15.09,17.45 8.61,10.97 4.65,10.97 4.34,10.67 4.34,9.53 4.95,8.91 5.79,8.91 USB.3
D-
  Top 0.152: U$2.23 16.38,18.29 16.92,17.75 16.92,17.22 10.36,10.67 4.8,10.67 4.65,10.52 4.65,9.91 4.95,9.6 5.79,9.6 USB.2
DB7  (via drill 0.35)
  Top 0.152: v46.25,23.62 45.49,22.86 45.49,20.04 42.98,17.53 42.67,17.53 ICE40UP5K.11 | v72.01,25.3 74.3,25.3 74.6,25.6 75.36,25.6 AD7606.24
  Bottom 0.152: v46.25,23.62 46.25,27.74 42.82,31.17 42.82,31.77 43.13,32.08 48.84,32.08 53.95,26.98 59.28,26.98 60.96,25.3 v72.01,25.3
DB8  (via drill 0.35)
  Top 0.152: v43.97,20.42 43.97,18.97 43.05,18.06 42.67,18.06 ICE40UP5K.12 | v46.41,21.03 46.86,21.03 50.22,24.38 53.11,24.38 53.34,24.61 v53.34,26.67 | v74.07,24.61 74.6,25.15 75.36,25.15 AD7606.25
  Bottom 0.152: v43.97,20.42 44.58,21.03 v46.41,21.03 | v53.34,26.67 54.18,26.67 60.27,20.57 70.03,20.57 v74.07,24.61
DIN  (via drill 0.35)
  Top 0.152: v35.28,17.53 36.04,17.53 ICE40UP5K.26 | v55.7,17.45 56.77,17.45 PCM5102.14
  Bottom 0.152: v35.28,17.53 45.49,17.53 46.33,16.69 53.34,16.69 54.1,17.45 v55.7,17.45
FDATA  (via drill 0.35)
  Top 0.152: v55.02,30.86 54.25,31.62 51.44,31.62 50.83,31.01 50.83,26.52 45.8,21.49 45.8,19.89 42.9,16.99 42.67,16.99 ICE40UP5K.10 | v76.81,31.85 77.27,32.31 77.8,32.31 78.03,32.08 78.03,31.32 AD7606.15
  Bottom 0.152: v55.02,30.86 61.65,30.86 62.48,30.02 74.98,30.02 v76.81,31.85
FLASH_H
  Top 0.152: U$1.3 28.57,8.99 28.57,11.28 27.28,12.57 27.28,13.87 U$1.7 27.28,13.95 27.28,15.09 28.88,16.69 28.88,21.79 33.3,26.21 33.3,27.89 F_R14.1
FLT  (via drill 0.35)
  Top 0.152: v33.22,16.92 33.22,15.09 35.81,12.5 36.04,12.5 ICE40UP5K.36 | v55.7,19.05 56.01,19.05 56.39,19.43 PCM5102.11
  Bottom 0.152: v33.22,16.92 33.68,16.92 34.9,18.14 48.54,18.14 49.45,19.05 v55.7,19.05
GND  (via drill 0.35)
  Top 0.305: U$2.28 19.89,16.31 19.89,16.15 18.97,15.24 16.31,15.24 15.93,14.86 15.93,10.06 17.22,8.76 17.75,8.76 C25.- 17.14,8.69 15.24,6.78 15.24,4.34 | 15.24,4.34 16.46,3.12 16.46,2.52 LED3.C 16.54,2.36 20.27,2.36 LED2.C 20.42,2.36 24.08,2.36 LED1.C 24.23,2.44 37.03,2.44 39.24,4.65 v39.24,4.8 | USB.5 5.79,7.54 5.33,7.54 2.97,5.18 USB.GND2 | C5.2 10.13,14.25 4.57,14.25 2.97,12.65 USB.GND1 3.05,12.5 3.05,9.37 5.03,7.39 USB.5 | 15.24,4.34 15.16,4.27 14.17,4.27 12.65,2.74 10.21,2.74 5.79,7.16 5.79,7.39 USB.5 | ICE40UP5K.EXP 39.32,15.24 37.11,13.03 37.11,12.12 ICE40UP5K.38 36.65,11.96 ICE40UP5K.37 36.5,11.89 34.59,9.98 | 34.59,9.98 33.3,8.69 32.69,8.69 32.46,8.91 29.95,8.91 U$1.4 | v57.84,14.25 56.84,14.25 PCM5102.19 | 57.3,16.15 v57.84,15.62 57.91,15.7 58.67,14.94 62.56,14.94 PCM5102.3 62.71,14.78 63.17,14.78 63.78,14.17 63.78,10.29 61.19,7.7 61.19,6.63 | 57.3,16.15 56.84,16.15 PCM5102.16 | 57.3,16.15 57.61,16.46 57.61,18.44 57.3,18.75 56.84,18.75 PCM5102.12 | 61.27,18.75 60.96,18.75 v59.44,17.22 | 61.27,18.75 62.56,18.75 PCM5102.9 | 42.52,4.27 40.69,2.44 C22.- | 42.52,4.27 42.98,4.72 45.72,4.72 S_C3.2 45.8,4.65 46.63,4.65 48.84,2.44 48.84,1.68 49.07,1.45 65.15,1.45 65.38,1.68 | S_C5.2 55.93,4.8 57.84,4.8 59.66,6.63 S_C4.1 59.82,6.63 61.19,6.63 | C7.2 64.77,6.71 67.36,6.71 68.58,7.92 R11.1 | 65.38,1.68 65.61,1.45 70.26,1.45 71.32,2.52 72.69,2.52 C6.2 | 65.38,1.68 65.38,6.63 C7.2 | 61.19,6.63 64.62,6.63 C7.2 | v35.2,9.37 34.59,9.98 | 42.52,4.27 v42.06,4.72 | C3.2 54.33,25.45 54.33,28.04 58.06,31.77 C10.2 58.22,31.85 58.52,32.16 58.52,35.51 C23.- 58.67,35.66 61.04,35.66 62.41,37.03 71.25,37.03 72.62,35.66 C19.2 72.77,35.51 72.77,34.29 73.53,33.53 76.58,33.53 78.56,35.51 C24.- 78.72,35.51 79.78,34.44 84.89,34.44
  Top 0.305: 84.89,34.44 84.89,32.54 84.51,32.16 84.51,31.47 AD7606.2 84.51,31.32 84.12,31.32 AD7606.3 83.97,31.32 83.67,31.32 AD7606.4 83.52,31.32 83.06,31.32 AD7606.5 83.06,31.17 83.06,30.4 77.8,25.15 | 84.89,34.44 84.89,35.51 C9.- | 22.25,28.27 22.25,24.38 U$2.10 | 22.25,28.27 21.34,29.18 C1.2 | 22.25,28.27 23.16,29.18 25.68,29.18 C2.2 25.83,29.26 27.89,31.32 30.56,31.32 32.38,33.15 34.29,33.15 35.13,32.31 35.13,31.85 C8.2 35.28,31.7 36.73,31.7 38.56,29.87 39.55,29.87 IC2.1 39.62,29.72 41.99,27.36 41.99,25.45 F_C26.- 42.14,25.3 43.13,24.31 46.86,24.31 47.85,25.3 C4.2 47.93,25.45 47.93,29.11 47.24,29.79 IC1.1 47.32,29.95 48.84,31.47 v50.37,31.47 | 61.49,29.18 61.49,32.77 63.32,34.59 63.32,35.51 C28.- | 61.49,29.18 61.49,28.8 58.45,25.76 S_C1.2 | C20.1 68.96,31.7 69.49,31.17 69.49,27.96 C21.1 69.65,27.89 69.88,27.89 70.56,27.2 75.29,27.2 AD7606.21 | AD7606.21 75.44,27.13 75.44,26.67 AD7606.22 75.59,26.67 76.28,26.67 77.8,25.15 | AD7606.21 75.44,27.28 75.44,27.58 AD7606.20 75.36,27.74 75.36,28.04 AD7606.19 75.44,28.19 75.44,28.57 AD7606.18 75.36,28.8 75.36,29.11 AD7606.17 75.51,29.18 75.82,29.49 v76.81,29.49 | v76.81,30.71 77.34,31.24 77.5,31.24 AD7606.16 | v65,29.11 63.55,29.11 C18.- | v61.27,29.18 61.49,29.18 | 82.45,18.52 82.37,18.44 81.69,18.44 81.53,18.59 81.53,19.36 AD7606.41 81.46,19.51 81.08,19.51 AD7606.40 81.08,19.66 81.08,20.34 80.85,20.57 78.49,20.57 78.41,20.5 | 82.45,18.52 82.53,18.59 82.53,19.43 AD7606.43 | 82.45,18.52 82.53,18.44 83.82,18.44 84.05,18.67 84.05,19.36 AD7606.46 84.05,19.51 84.51,19.51 AD7606.47 84.51,19.66 84.51,20.34 85.34,21.18 88.09,21.18 88.24,21.34 88.24,22.17 88.16,22.25
  Top 0.305: AD7606.28 75.44,23.7 75.44,24.08 AD7606.27 75.44,24.23 75.44,24.61 AD7606.26 | 77.04,19.96 75.44,21.57 AD7606.32 75.44,21.72 75.44,22.1 AD7606.31 75.36,22.25 75.36,22.55 AD7606.30 75.44,22.71 75.44,23.09 AD7606.29 75.36,23.24 75.36,23.55 AD7606.28 | 77.04,19.96 77.5,19.51 AD7606.33 | 78.41,20.5 78.33,20.57 77.65,20.57 77.04,19.96 | 78.41,20.5 78.49,20.42 78.49,19.51 AD7606.35 | PWR.5 92.73,7.62 92.73,5.11 PWR.7 92.81,5.11 95.25,5.11 PWR.8 | PWR.3 92.73,10.13 92.73,7.7 PWR.5 | PWR.5 PWR.6 | PWR.4 95.25,10.21 92.81,10.21 PWR.3 | 88.16,22.25 88.24,22.33 88.24,22.94 88.16,23.01 | 88.16,22.25 88.09,22.17 87.25,22.17 AD7606.50 | 88.16,23.01 88.01,23.16 87.25,23.16 AD7606.52 | 88.16,24 88.24,23.93 88.24,23.09 88.16,23.01 | 88.16,24 88.01,24.16 87.25,24.16 AD7606.54 | 88.24,24.16 88.24,24.08 88.16,24 | 88.24,24.16 88.24,24.99 88.09,25.15 87.25,25.15 AD7606.56 87.1,25.15 86.33,25.15 86.11,25.38 86.11,25.91 86.33,26.14 | 86.33,26.14 87.17,26.14 AD7606.58 | 86.18,27.05 86.11,26.98 86.11,26.36 86.33,26.14 | 86.18,27.05 86.26,27.13 87.17,27.13 AD7606.60 | 86.18,27.05 86.11,27.13 86.11,27.96 86.26,28.12 87.17,28.12 AD7606.62 87.33,28.19 88.09,28.19 88.24,28.35 88.24,28.96 88.09,29.11 87.25,29.11 AD7606.64 | 88.24,24.16 92.58,24.16 SV4.6 92.73,24.08 92.73,21.72 SV4.4 92.73,21.57 92.73,19.05 SV4.2 92.58,18.97 91.59,17.98 91.59,12.27 92.81,11.05 92.81,10.36 PWR.3 | 77.8,25.15 77.88,25.07 77.88,24.08 77.5,23.7 75.59,23.7 AD7606.28 | v61.27,25.91 61.27,18.75
  Bottom 0.305: SV3.1 6.33,19.05 6.33,16 2.97,12.65 USB.GND1 | v57.84,14.25 v57.84,15.62 v59.44,17.22 | v35.2,9.37 37.41,9.37 40.62,6.17 | v42.06,4.72 40.62,6.17 | 40.62,6.17 v39.24,4.8 | v76.81,30.71 v76.81,29.49 76.43,29.11 v65,29.11 64.92,29.18 v61.27,29.18 60.5,28.42 | v50.37,31.47 51.97,31.47 55.02,28.42 60.5,28.42 | v61.27,25.91 61.27,27.66 60.5,28.42
LRCK  (via drill 0.35)
  Top 0.152: v34.59,16.92 34.59,17.75 34.98,18.14 35.59,18.14 35.66,18.06 36.04,18.06 ICE40UP5K.25 | v52.73,16.08 55.63,16.08 56.31,16.76 56.77,16.76 PCM5102.15
  Bottom 0.152: v34.59,16.92 45.64,16.92 46.48,16.08 v52.73,16.08
N$1  (via drill 0.35)
  Top 0.152: v21.57,17.22 20.73,16.38 U$2.29 | v27.28,18.67 27.28,22.25 29.95,24.92 29.95,28.35 33.3,31.7 C8.1
  Bottom 0.152: v21.57,17.22 23.32,17.22 25.07,18.97 26.98,18.97 v27.28,18.67
N$6  (via drill 0.35)
  Top 0.152: v85.42,25.22 85.57,25.38 85.57,28.04 86.11,28.57 87.17,28.57 AD7606.63
  Bottom 0.152: v85.42,25.22 85.42,24.69 86.18,23.93 86.18,23.32 84.28,21.41 83.67,21.41 83.36,21.11 83.36,20.5 83.82,20.04 94.26,20.04 SV4.1
N$7
  Top 0.152: AD7606.61 87.25,27.66 91.82,27.66 92.13,27.96 95.86,27.96 96.55,27.28 96.55,22.94 95.25,21.64 SV4.3
N$8
  Top 0.152: AD7606.59 87.25,26.67 91.29,26.67 92.28,27.66 95.71,27.66 96.24,27.13 96.24,25.15 95.25,24.16 SV4.5
N$12  (via drill 0.35)
  Top 0.152: v34.59,14.63 33.83,15.39 33.83,17.45 34.82,18.44 36.58,18.44 ICE40UP5K.24 | v48.31,12.8 49.15,11.96 49.15,9.07 D1.2
  Bottom 0.152: v34.59,14.63 42.75,14.63 44.58,12.8 v48.31,12.8
N$13
  Top 0.152: SV4.7 94.26,25.68 87.25,25.68 AD7606.57
N$14
  Top 0.152: AD7606.55 87.17,24.61 85.11,24.61 84.12,25.6 84.12,27.36 87.02,30.25 94.26,30.25 95.25,29.26 SV4.9
N$16  (via drill 0.35)
  Top 0.152: v85.57,23.62 87.17,23.62 AD7606.53 | v83.44,23.39 83.44,23.85 82.91,24.38 82.91,27.89 91.67,36.65 91.67,37.26 92.28,37.87 95.63,37.87 96.24,37.26 96.24,32.77 95.25,31.77 SV4.11
  Bottom 0.152: v85.57,23.62 85.19,23.62 84.96,23.39 v83.44,23.39
N$17  (via drill 0.35)
  Top 0.152: v84.73,24.08 84.73,23.55 85.57,22.71 87.17,22.71 AD7606.51 | v84.73,26.06 84.73,27.05 v84.96,27.28
  Bottom 0.152: v84.73,26.06 v84.73,24.08 | v84.96,27.28 86.79,27.28 92.81,33.3 94.26,33.3 SV4.13
N$19
  Top 0.152: R3.2 21.57,9.14 20.42,9.14 16.54,5.26 LED3.A
N$20
  Top 0.152: R_I2.2 21.72,3.81 20.34,5.18 LED2.A
N$21
  Top 0.152: I_L1.2 36.35,3.81 35.36,2.82 29.41,2.82 29.18,3.05 29.18,4.65 28.65,5.18 24.16,5.18 LED1.A
N$22
  Top 0.152: ICE40UP5K.39 37.57,11.96 37.57,10.82 34.44,7.7 24.99,7.7 21.64,11.05 R3.1
N$23
  Top 0.152: R_I2.1 31.01,3.81 38.1,10.9 38.1,11.96 ICE40UP5K.40
N$24
  Top 0.152: ICE40UP5K.41 38.56,11.96 38.56,7.7 34.67,3.81 I_L1.1
N$25
  Top 0.152: 85.34,7.32 85.34,7.54 86.64,8.84 R6.1 | 85.34,7.32 85.34,4.04 86.33,3.05 86.33,2.9 C12.2 | 85.34,7.32 80.09,7.32 79.4,8 79.4,8.91 IC4.7
N$26
  Top 0.152: 73.69,4.65 77.27,4.65 78.11,3.81 IC4.1 | 73.69,4.65 72.85,4.65 70.79,2.59 68.28,2.59 C11.2 | 73.69,4.65 73.69,10.97 73.91,11.2 73.91,13.95 R8.1
N$27  (via drill 0.35)
  Top 0.152: v70.56,6.78 66.37,2.59 C11.1 | v74.3,7.7 74.3,6.71 74.6,6.4 R9.2 74.68,6.33 77.27,6.33 79.32,4.27 79.32,3.81 IC4.2 79.4,3.73 79.4,3.2 80.62,1.98 87.25,1.98 89.46,4.19 89.46,9.75 86.72,12.5 86.72,12.65 R5.1
  Bottom 0.152: v70.56,6.78 73.38,6.78 v74.3,7.7
N$29
  Top 0.152: C12.1 86.41,4.8 86.41,6.86 87.63,8.08 87.63,9.68 87.02,10.29 81.46,10.29 80.7,9.53 80.7,8.99 IC4.6 80.85,9.75 80.05,10.55 | 80.05,10.55 80.01,10.59 77.11,10.59 76.73,10.21 74.68,10.21 R7.2 | 80.05,10.55 80.31,10.82 80.31,12.65 R4.1
N$37  (via drill 0.35)
  Top 0.152: v50.6,9.75 56.31,15.47 56.77,15.47 PCM5102.17 | v49.99,3.89 49.99,2.67 49.91,2.59 S_R2.1
  Bottom 0.152: v50.6,9.75 50.6,4.5 v49.99,3.89
N$38  (via drill 0.35)
  Top 0.152: v63.09,21.49 62.64,21.03 62.64,19.51 PCM5102.10 | v64.31,21.49 64.31,21.03 v67.28,18.06 | v61.95,4.27 61.95,2.59 S_R1.1
  Bottom 0.152: v64.31,21.49 v63.09,21.49 | v67.28,18.06 67.28,9.6 v61.95,4.27
N$39
  Top 0.152: PCM5102.18 56.84,14.86 58.14,14.86 58.45,14.55 58.45,9.83 59.66,8.61 S_C4.2
N$40
  Top 0.152: AD7606.49 87.17,21.72 86.03,21.72 83.21,24.54 83.21,27.36 91.67,35.81 94.26,35.81 95.25,36.8 SV4.15
OUTL
  Top 0.152: 64.77,8.84 C7.1 64.77,8.61 | 64.77,8.84 64.77,15.01 63.02,16.76 62.64,16.76 PCM5102.6 | 64.77,8.84 69.42,8.84 71.86,6.4 72.69,6.4 R9.1
OUTR  (via drill 0.35)
  Top 0.152: PCM5102.7 62.64,17.45 70.33,17.45 72.69,15.09 72.69,10.21 R7.1 72.77,10.13 73.08,9.83 v73.08,8.84 | v74.68,4.04 74.68,2.59 C6.1
  Bottom 0.152: v74.68,4.04 74.68,7.16 74.91,7.39 74.91,8 74.07,8.84 v73.08,8.84
PULLUP  (via drill 0.35)
  Top 0.152: AD7606.6 82.53,31.32 82.07,31.32 AD7606.7 81.99,31.32 81.53,31.32 AD7606.8 81.46,31.24 81.46,30.48 v80.62,29.64 | v43.43,31.47 37.57,31.47 33.53,35.51 33.38,35.51 R15.1 | v71.7,21.18 72.77,21.18 74.52,19.43 76.35,19.43 77.27,18.52 77.8,18.52 78.03,18.75 78.03,19.43 AD7606.34
  Bottom 0.152: v43.43,31.47 47.62,31.47 58.83,20.27 70.79,20.27 v71.7,21.18 80.16,29.64 v80.62,29.64
Q1
  Top 0.152: U$2.1 24.31,17.53 23.93,17.91 23.85,17.91 19.51,22.25 19.51,29.11 19.43,29.18 C1.1 19.36,29.26 18.21,30.4 18.21,32.46 Q2.1
Q2  (via drill 0.35)
  Top 0.152: v28.42,26.9 28.42,26.29 26.21,24.08 26.21,18.29 25.68,17.75 25.07,17.75 24.54,18.29 24.38,18.29 U$2.2 | C2.1 27.58,29.18 v27.58,27.89 23.39,23.7 21.26,23.7 21.11,23.85 21.11,24.77 20.34,25.53 20.34,32.46 18.21,34.59 18.21,36.04 Q2.4
  Bottom 0.152: v28.42,26.9 28.42,27.05 v27.58,27.89
RDCLK
  Top 0.152: ICE40UP5K.4 42.67,14.02 43.81,14.02 48.62,18.82 48.62,20.88 51.51,23.77 58.22,23.77 61.87,27.43 61.87,32.54 62.79,33.45 65.99,33.45 66.67,32.77 72.77,32.77 75.44,30.1 79.1,30.1 79.48,30.48 79.48,31.24 AD7606.12
REF_INOUT  (via drill 0.35)
  Top 0.152: v82.07,28.42 82.07,19.51 AD7606.42 | v87.71,34.06 87.71,35.51 C9.+
  Bottom 0.152: v87.71,34.06 v82.07,28.42
REFCAP  (via drill 0.35)
  Top 0.152: AD7606.44 83.06,19.51 83.52,19.51 AD7606.45 83.52,19.58 83.52,20.34 v83.97,20.8 | v71.48,35.59 66.22,35.59 C28.+
  Bottom 0.152: v71.48,35.59 79.7,35.59 81.99,37.87 93.12,37.87 94.26,36.73 94.26,36.35 95.33,35.28 95.71,35.28 96.24,34.75 96.24,23.7 95.17,22.63 94.87,22.63 93.73,21.49 93.73,21.18 93.12,20.57 84.2,20.57 v83.97,20.8
REGCAP1  (via drill 0.35)
  Top 0.152: v70.87,27.89 70.87,31.7 C20.2 | v70.87,25.91 70.87,24 v74.83,20.04 | v76.05,18.82 76.5,18.82 77.11,18.21 78.49,18.21 79.02,18.75 79.02,19.43 AD7606.36
  Bottom 0.152: v70.87,25.91 v70.87,27.89 | v76.05,18.82 v74.83,20.04
REGCAP2
  Top 0.152: AD7606.39 80.54,19.43 80.54,17.91 80.24,17.6 74.37,17.6 67.67,24.31 67.67,27.89 C21.2
RES  (via drill 0.35)
  Top 0.152: v49.07,17.3 47.85,17.3 44.12,13.56 42.67,13.56 ICE40UP5K.3 | v53.65,19.96 v50.98,17.3 | v80.01,28.57 80.01,31.24 AD7606.11
  Bottom 0.152: v50.98,17.3 v49.07,17.3 | v53.65,19.96 71.4,19.96 v80.01,28.57
RESET  (via drill 0.35)
  Top 0.152: v47.47,20.27 43.2,16 42.67,16 ICE40UP5K.8 | v16.92,25.6 16.92,22.86 16.38,22.33 U$2.18
  Bottom 0.152: v47.47,20.27 47.47,20.88 46.71,21.64 38.25,21.64 37.19,20.57 31.77,20.57 26.44,25.91 16.92,25.91 | 16.92,25.91 12.19,25.91 SV3.11 | 16.92,25.91 v16.92,25.6
RST  (via drill 0.35)
  Top 0.152: v17.53,17.53 18.29,16.76 18.29,16.38 U$2.26 | R17.1 12.65,32.84 12.65,31.55 6.25,25.15 4.8,25.15 3.81,24.16 SV3.6
  Bottom 0.152: v17.53,17.53 16.23,17.53 13.11,20.65 13.11,21.03 11.05,23.09 4.8,23.09 3.81,24.08 SV3.6
SI  (via drill 0.35)
  Top 0.152: SV3.3 6.4,21.57 8.84,19.13 16.31,19.13 U$2.22 16.38,19.05 21.26,19.05 v24.08,16.23 | ICE40UP5K.17 40.16,18.52 40.16,19.66 40.23,19.74 40.23,20.34 36.42,24.16 31.7,24.16 29.18,21.64 v29.18,12.72 29.18,8.15 29.03,8 28.19,8 27.28,8.91 U$1.2
  Bottom 0.152: v24.08,16.23 24.08,15.7 27.05,12.72 v29.18,12.72
SO  (via drill 0.35)
  Top 0.152: SV3.5 10.52,19.96 16.31,19.96 U$2.21 16.38,19.89 21.11,19.89 24.16,16.84 24.38,16.84 24.69,16.54 24.69,15.93 24.16,15.39 v23.24,15.39 | v42.82,18.75 42.52,19.05 41.91,19.05 41.68,18.82 41.68,18.52 ICE40UP5K.14 | v31.39,16.84 31.39,16.31 29.95,14.86 29.95,13.95 U$1.5
  Bottom 0.152: v42.82,18.75 33.3,18.75 v31.39,16.84 28.96,19.28 22.71,19.28 20.95,17.53 20.95,16.92 21.26,16.61 22.02,16.61 v23.24,15.39
SS  (via drill 0.35)
  Top 0.152: v40.54,20.95 40.62,20.88 ICE40UP5K.16 | U$2.19 16.31,21.49 v15.39,21.49 13.79,21.49 12.88,20.57 v12.19,20.57 | v16.61,13.64 20.8,13.64 25.45,8.99 25.91,8.99 U$1.1
  Bottom 0.152: v40.54,20.95 38.02,20.95 37.03,19.96 29.64,19.96 29.41,20.19 15.85,20.19 14.97,21.07 | 14.97,21.07 6.86,29.18 6.4,29.18 SV3.9 | 14.97,21.07 v15.39,21.49 | v16.61,13.64 12.19,18.06 v12.19,20.57
SWCLK  (via drill 0.35)
  Top 0.152: v18.75,17.83 21.87,17.83 22.25,17.45 22.25,16.38 U$2.31 | v13.56,18.52 8.31,18.52 6.25,20.57 4.8,20.57 3.81,21.57 SV3.4
  Bottom 0.152: v18.75,17.83 17.83,16.92 15.16,16.92 v13.56,18.52
SWIO  (via drill 0.35)
  Top 0.152: v22.33,15.39 23.09,16.15 23.09,16.31 U$2.32 | v20.19,15.39 19.74,15.39 18.9,14.55 v16.61,14.55
  Bottom 0.152: v20.19,15.39 v22.33,15.39 | v16.61,14.55 12.8,18.36 12.8,20.88 12.5,21.18 7.39,21.18 6.25,20.04 4.8,20.04 SV3.2
T37  (via drill 0.35)
  Top 0.152: v35.43,21.72 37.11,20.04 ICE40UP5K.23
  Bottom 0.152: v35.43,21.72 35.43,23.24 22.86,35.81 4.8,35.81 3.81,36.8 SV3.16
USB_5V
  Top 0.152: PWR_UE.1 9.68,5.56 9.68,7.09 6.63,10.13 5.87,10.13 USB.1
V165  (via drill 0.35)
  Top 0.152: R10.1 69.8,14.25 68.58,13.03 R11.2 v71.48,9.83 | 77.57,9.83 77.57,10.21 77.65,10.29 79.78,10.29 80.09,9.98 80.09,7.77 80.24,7.62 81.08,7.62 81.92,8.46 IC4.5 | 77.57,9.83 77.57,7.7 80.62,4.65 80.62,3.81 IC4.3 | 77.57,9.83 v77.27,9.83
  Bottom 0.152: v77.27,9.83 v71.48,9.83
VCC  (via drill 0.35)
  Top 0.152: ICE40UP5K.29 36.12,15.93 36.12,15.54 ICE40UP5K.30 36.04,15.47 35.81,15.47 35.59,15.24 v35.28,15.24 | v43.59,14.71 43.43,14.55 42.67,14.55 ICE40UP5K.5 | C5.1 10.13,16.15 3.58,16.15 1.45,14.02 1.45,3.81 3.96,1.29 36.73,1.29 40.62,5.18 C22.+ 40.69,5.26 41.22,5.26 45.8,9.83 45.8,12.5 45.49,12.8 | 45.49,12.8 v44.88,13.41 | v41.91,33.76 IC2.4 | v49.23,20.57 49.23,18.06 49.68,17.6 49.68,16.99 45.49,12.8
  Bottom 0.152: v35.28,15.24 42.6,15.24 43.13,14.71 v43.59,14.71 v44.88,13.41 | v41.91,33.76 41.91,27.05 48.39,20.57 v49.23,20.57
VNEG  (via drill 0.35)
  Top 0.152: v61.87,7.39 61.87,7.47 64.16,9.75 64.16,15.01 63.02,16.15 62.64,16.15 PCM5102.5 | v47.02,3.28 46.1,3.28 45.72,2.9 S_C3.1
  Bottom 0.152: v61.87,7.39 54.41,7.39 50.29,3.28 v47.02,3.28

### Text on the board
tNames: T37 | O_L | 3V3 | I1 | B23 | CDN | O_R | I2 | B25 | RES | +12 | I3 | B29 | SS | -12 | I4 | B31 | CLK | 5V | I5 | RST | SO | I6 | GND | WCK | SI | GND | I7 | SWIO | GND | GND | I8